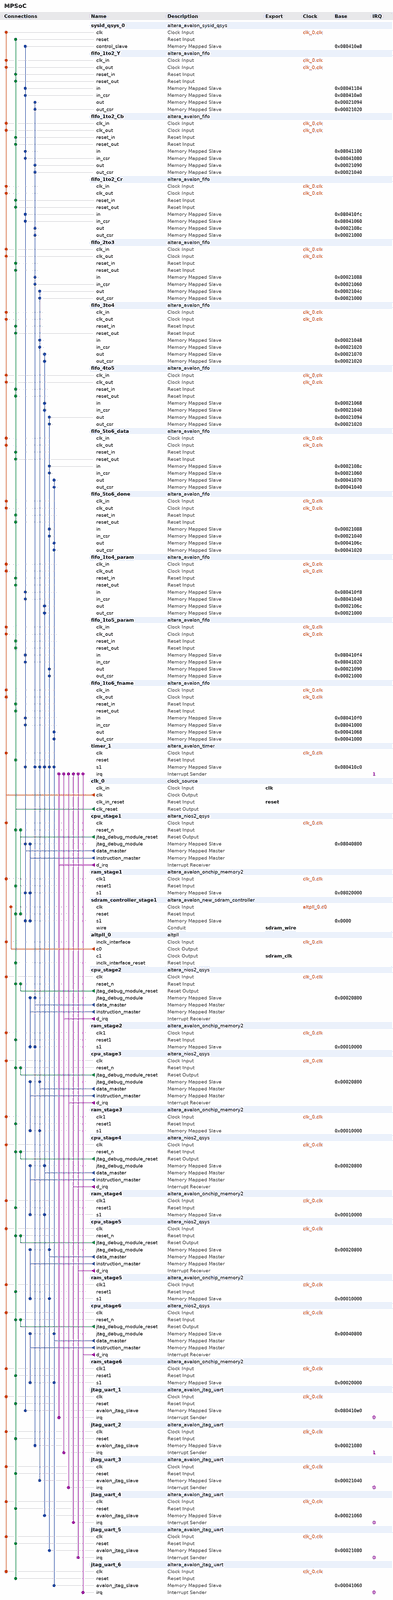
[diagram p0: system contents, whole]
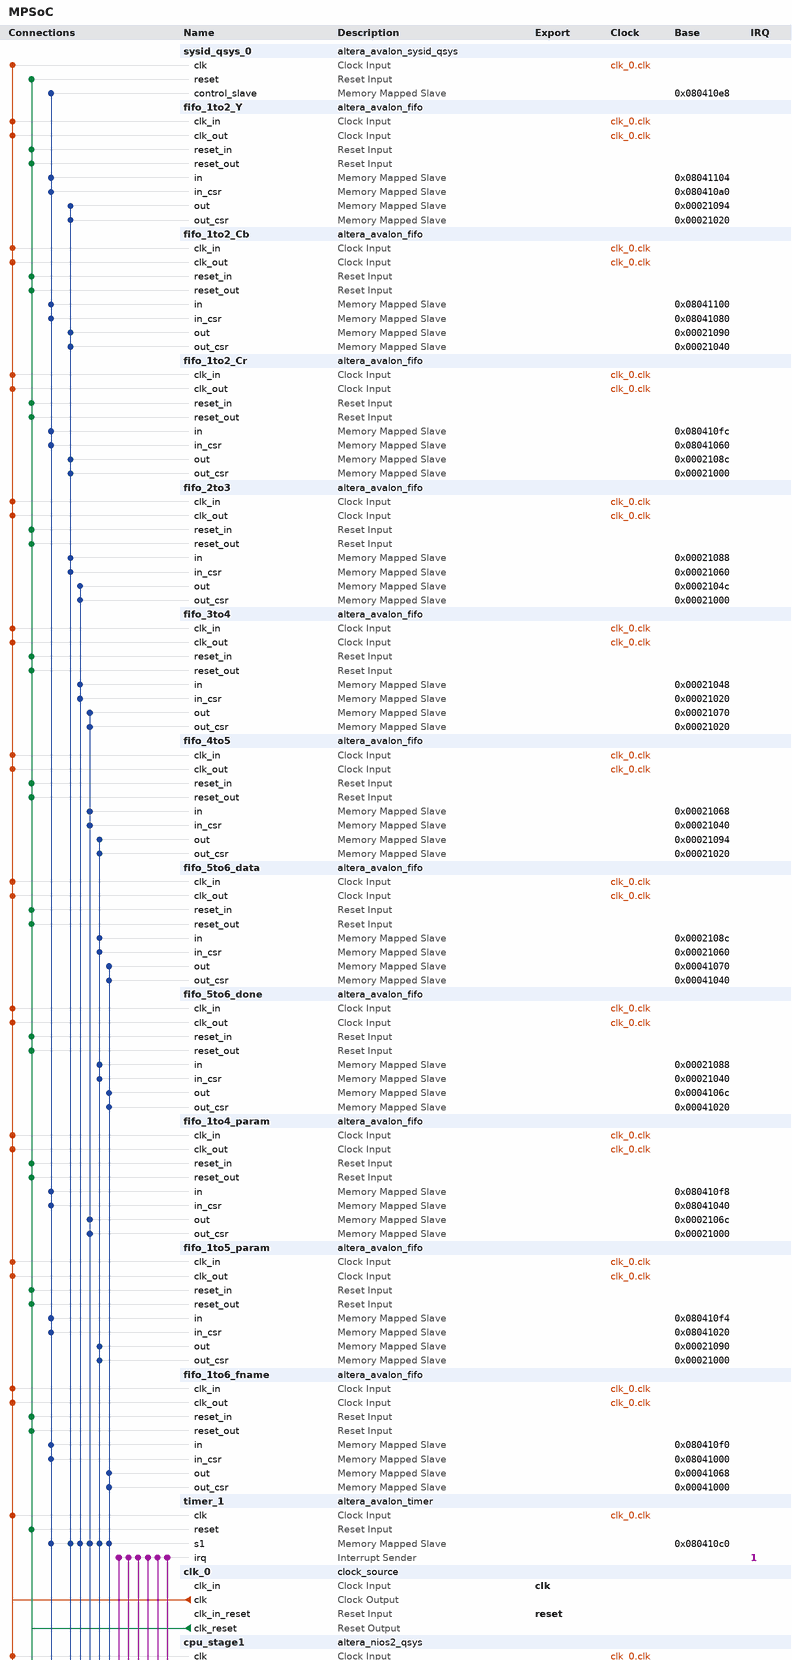
[diagram p1: system contents, upper part]
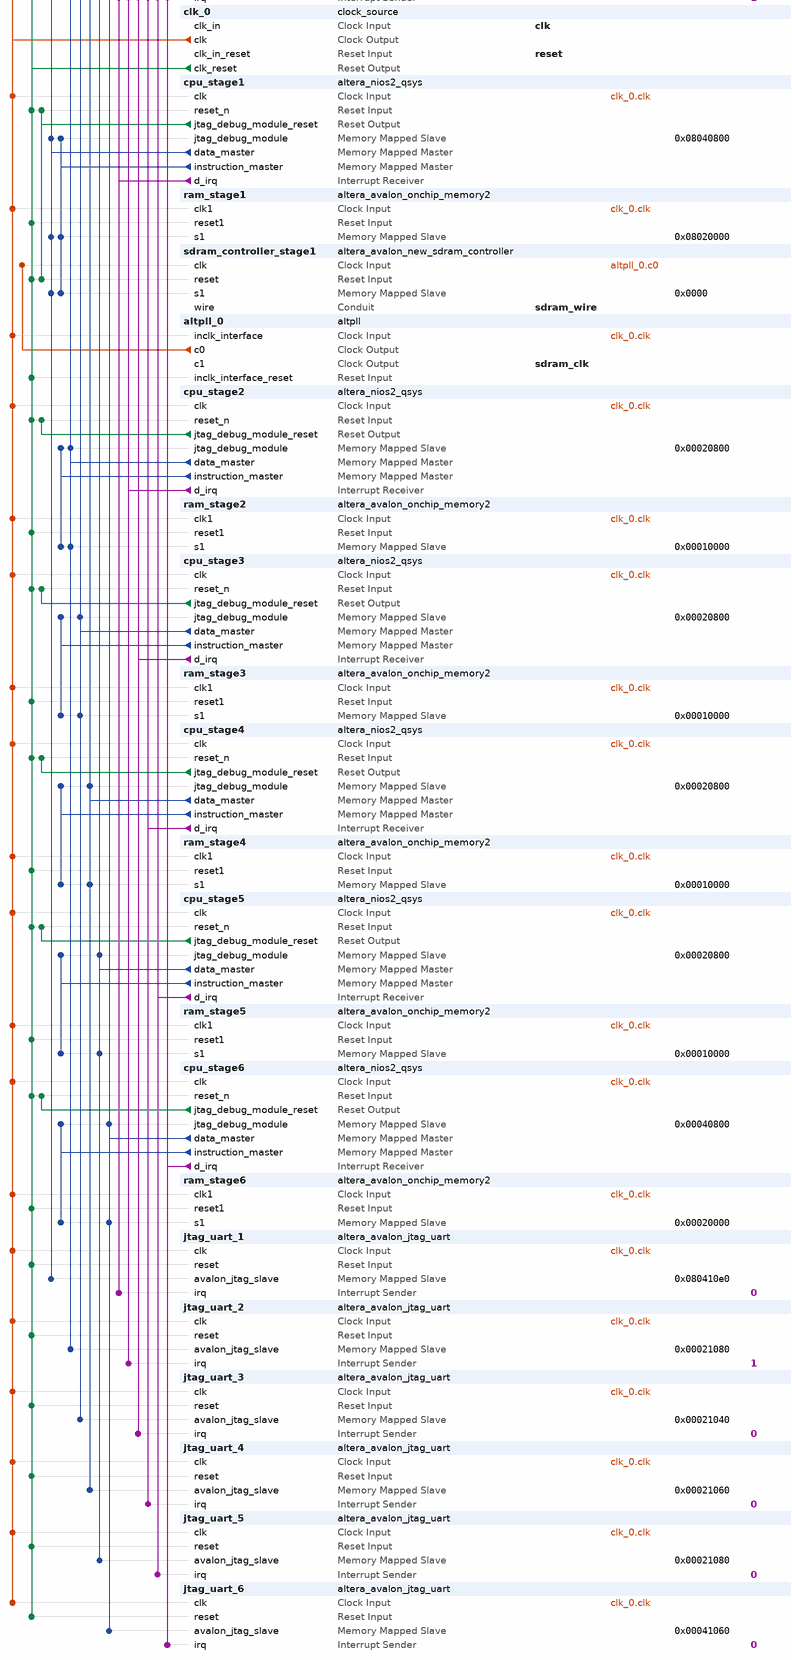
[diagram p2: system contents, lower part]
# Platform Designer (Qsys) system MPSoC, Cyclone IV E EP4CE115F29C7
# Parameters at their usual value, and those the tool derives, are not listed.
package require -exact qsys 13.1
create_system MPSoC
set_project_property DEVICE_FAMILY {Cyclone IV E}
set_project_property DEVICE EP4CE115F29C7

add_instance sysid_qsys_0 altera_avalon_sysid_qsys 13.1
set_instance_parameter_value sysid_qsys_0 id 0

add_instance fifo_1to2_Y altera_avalon_fifo 13.1
set_instance_parameter_value fifo_1to2_Y bitsPerSymbol 16
set_instance_parameter_value fifo_1to2_Y channelWidth 8
set_instance_parameter_value fifo_1to2_Y errorWidth 8
set_instance_parameter_value fifo_1to2_Y fifoDepth 64
set_instance_parameter_value fifo_1to2_Y fifoInputInterfaceOptions AVALONMM_WRITE
set_instance_parameter_value fifo_1to2_Y fifoOutputInterfaceOptions AVALONMM_READ
set_instance_parameter_value fifo_1to2_Y singleClockMode false
set_instance_parameter_value fifo_1to2_Y symbolsPerBeat 1
set_instance_parameter_value fifo_1to2_Y useIRQ false
set_instance_parameter_value fifo_1to2_Y usePacket false
set_instance_parameter_value fifo_1to2_Y useReadControl true

add_instance fifo_1to2_Cb altera_avalon_fifo 13.1
set_instance_parameter_value fifo_1to2_Cb bitsPerSymbol 16
set_instance_parameter_value fifo_1to2_Cb channelWidth 8
set_instance_parameter_value fifo_1to2_Cb errorWidth 8
set_instance_parameter_value fifo_1to2_Cb fifoDepth 64
set_instance_parameter_value fifo_1to2_Cb fifoInputInterfaceOptions AVALONMM_WRITE
set_instance_parameter_value fifo_1to2_Cb fifoOutputInterfaceOptions AVALONMM_READ
set_instance_parameter_value fifo_1to2_Cb singleClockMode false
set_instance_parameter_value fifo_1to2_Cb symbolsPerBeat 1
set_instance_parameter_value fifo_1to2_Cb useIRQ false
set_instance_parameter_value fifo_1to2_Cb usePacket false
set_instance_parameter_value fifo_1to2_Cb useReadControl true

add_instance fifo_1to2_Cr altera_avalon_fifo 13.1
set_instance_parameter_value fifo_1to2_Cr bitsPerSymbol 16
set_instance_parameter_value fifo_1to2_Cr channelWidth 8
set_instance_parameter_value fifo_1to2_Cr errorWidth 8
set_instance_parameter_value fifo_1to2_Cr fifoDepth 64
set_instance_parameter_value fifo_1to2_Cr fifoInputInterfaceOptions AVALONMM_WRITE
set_instance_parameter_value fifo_1to2_Cr fifoOutputInterfaceOptions AVALONMM_READ
set_instance_parameter_value fifo_1to2_Cr singleClockMode false
set_instance_parameter_value fifo_1to2_Cr symbolsPerBeat 1
set_instance_parameter_value fifo_1to2_Cr useIRQ false
set_instance_parameter_value fifo_1to2_Cr usePacket false
set_instance_parameter_value fifo_1to2_Cr useReadControl true

add_instance fifo_2to3 altera_avalon_fifo 13.1
set_instance_parameter_value fifo_2to3 bitsPerSymbol 16
set_instance_parameter_value fifo_2to3 channelWidth 8
set_instance_parameter_value fifo_2to3 errorWidth 8
set_instance_parameter_value fifo_2to3 fifoDepth 64
set_instance_parameter_value fifo_2to3 fifoInputInterfaceOptions AVALONMM_WRITE
set_instance_parameter_value fifo_2to3 fifoOutputInterfaceOptions AVALONMM_READ
set_instance_parameter_value fifo_2to3 singleClockMode false
set_instance_parameter_value fifo_2to3 symbolsPerBeat 1
set_instance_parameter_value fifo_2to3 useIRQ false
set_instance_parameter_value fifo_2to3 usePacket false
set_instance_parameter_value fifo_2to3 useReadControl true

add_instance fifo_3to4 altera_avalon_fifo 13.1
set_instance_parameter_value fifo_3to4 bitsPerSymbol 16
set_instance_parameter_value fifo_3to4 channelWidth 8
set_instance_parameter_value fifo_3to4 errorWidth 8
set_instance_parameter_value fifo_3to4 fifoDepth 64
set_instance_parameter_value fifo_3to4 fifoInputInterfaceOptions AVALONMM_WRITE
set_instance_parameter_value fifo_3to4 fifoOutputInterfaceOptions AVALONMM_READ
set_instance_parameter_value fifo_3to4 singleClockMode false
set_instance_parameter_value fifo_3to4 symbolsPerBeat 1
set_instance_parameter_value fifo_3to4 useIRQ false
set_instance_parameter_value fifo_3to4 usePacket false
set_instance_parameter_value fifo_3to4 useReadControl true

add_instance fifo_4to5 altera_avalon_fifo 13.1
set_instance_parameter_value fifo_4to5 bitsPerSymbol 16
set_instance_parameter_value fifo_4to5 channelWidth 8
set_instance_parameter_value fifo_4to5 errorWidth 8
set_instance_parameter_value fifo_4to5 fifoDepth 64
set_instance_parameter_value fifo_4to5 fifoInputInterfaceOptions AVALONMM_WRITE
set_instance_parameter_value fifo_4to5 fifoOutputInterfaceOptions AVALONMM_READ
set_instance_parameter_value fifo_4to5 singleClockMode false
set_instance_parameter_value fifo_4to5 symbolsPerBeat 1
set_instance_parameter_value fifo_4to5 useIRQ false
set_instance_parameter_value fifo_4to5 usePacket false
set_instance_parameter_value fifo_4to5 useReadControl true

add_instance fifo_5to6_data altera_avalon_fifo 13.1
set_instance_parameter_value fifo_5to6_data bitsPerSymbol 8
set_instance_parameter_value fifo_5to6_data channelWidth 8
set_instance_parameter_value fifo_5to6_data errorWidth 8
set_instance_parameter_value fifo_5to6_data fifoDepth 64
set_instance_parameter_value fifo_5to6_data fifoInputInterfaceOptions AVALONMM_WRITE
set_instance_parameter_value fifo_5to6_data fifoOutputInterfaceOptions AVALONMM_READ
set_instance_parameter_value fifo_5to6_data singleClockMode false
set_instance_parameter_value fifo_5to6_data symbolsPerBeat 1
set_instance_parameter_value fifo_5to6_data useIRQ false
set_instance_parameter_value fifo_5to6_data usePacket false
set_instance_parameter_value fifo_5to6_data useReadControl true

add_instance fifo_5to6_done altera_avalon_fifo 13.1
set_instance_parameter_value fifo_5to6_done bitsPerSymbol 8
set_instance_parameter_value fifo_5to6_done channelWidth 8
set_instance_parameter_value fifo_5to6_done errorWidth 8
set_instance_parameter_value fifo_5to6_done fifoDepth 8
set_instance_parameter_value fifo_5to6_done fifoInputInterfaceOptions AVALONMM_WRITE
set_instance_parameter_value fifo_5to6_done fifoOutputInterfaceOptions AVALONMM_READ
set_instance_parameter_value fifo_5to6_done singleClockMode false
set_instance_parameter_value fifo_5to6_done symbolsPerBeat 1
set_instance_parameter_value fifo_5to6_done useIRQ false
set_instance_parameter_value fifo_5to6_done usePacket false
set_instance_parameter_value fifo_5to6_done useReadControl true

add_instance fifo_1to4_param altera_avalon_fifo 13.1
set_instance_parameter_value fifo_1to4_param bitsPerSymbol 32
set_instance_parameter_value fifo_1to4_param channelWidth 8
set_instance_parameter_value fifo_1to4_param errorWidth 8
set_instance_parameter_value fifo_1to4_param fifoDepth 8
set_instance_parameter_value fifo_1to4_param fifoInputInterfaceOptions AVALONMM_WRITE
set_instance_parameter_value fifo_1to4_param fifoOutputInterfaceOptions AVALONMM_READ
set_instance_parameter_value fifo_1to4_param singleClockMode false
set_instance_parameter_value fifo_1to4_param symbolsPerBeat 1
set_instance_parameter_value fifo_1to4_param useIRQ false
set_instance_parameter_value fifo_1to4_param usePacket false
set_instance_parameter_value fifo_1to4_param useReadControl true

add_instance fifo_1to5_param altera_avalon_fifo 13.1
set_instance_parameter_value fifo_1to5_param bitsPerSymbol 32
set_instance_parameter_value fifo_1to5_param channelWidth 8
set_instance_parameter_value fifo_1to5_param errorWidth 8
set_instance_parameter_value fifo_1to5_param fifoDepth 8
set_instance_parameter_value fifo_1to5_param fifoInputInterfaceOptions AVALONMM_WRITE
set_instance_parameter_value fifo_1to5_param fifoOutputInterfaceOptions AVALONMM_READ
set_instance_parameter_value fifo_1to5_param singleClockMode false
set_instance_parameter_value fifo_1to5_param symbolsPerBeat 1
set_instance_parameter_value fifo_1to5_param useIRQ false
set_instance_parameter_value fifo_1to5_param usePacket false
set_instance_parameter_value fifo_1to5_param useReadControl true

add_instance fifo_1to6_fname altera_avalon_fifo 13.1
set_instance_parameter_value fifo_1to6_fname bitsPerSymbol 8
set_instance_parameter_value fifo_1to6_fname channelWidth 8
set_instance_parameter_value fifo_1to6_fname errorWidth 8
set_instance_parameter_value fifo_1to6_fname fifoDepth 128
set_instance_parameter_value fifo_1to6_fname fifoInputInterfaceOptions AVALONMM_WRITE
set_instance_parameter_value fifo_1to6_fname fifoOutputInterfaceOptions AVALONMM_READ
set_instance_parameter_value fifo_1to6_fname singleClockMode false
set_instance_parameter_value fifo_1to6_fname symbolsPerBeat 1
set_instance_parameter_value fifo_1to6_fname useIRQ false
set_instance_parameter_value fifo_1to6_fname usePacket false
set_instance_parameter_value fifo_1to6_fname useReadControl true

add_instance timer_1 altera_avalon_timer 13.1
set_instance_parameter_value timer_1 period 1
set_instance_parameter_value timer_1 periodUnits MSEC

add_instance clk_0 clock_source 13.1
set_instance_parameter_value clk_0 clockFrequency 50000000

add_instance cpu_stage1 altera_nios2_qsys 13.1
set_instance_parameter_value cpu_stage1 resetSlave ram_stage1.s1
set_instance_parameter_value cpu_stage1 mmu_TLBMissExcSlave None
set_instance_parameter_value cpu_stage1 exceptionSlave ram_stage1.s1
set_instance_parameter_value cpu_stage1 breakSlave cpu_stage1.jtag_debug_module
set_instance_parameter_value cpu_stage1 impl Tiny
set_instance_parameter_value cpu_stage1 icache_size 4096

add_instance ram_stage1 altera_avalon_onchip_memory2 13.1
set_instance_parameter_value ram_stage1 dataWidth 32
set_instance_parameter_value ram_stage1 dualPort false
set_instance_parameter_value ram_stage1 initMemContent true
set_instance_parameter_value ram_stage1 initializationFileName onchip_mem.hex
set_instance_parameter_value ram_stage1 memorySize 96000

add_instance sdram_controller_stage1 altera_avalon_new_sdram_controller 13.1
set_instance_parameter_value sdram_controller_stage1 TAC 6.0
set_instance_parameter_value sdram_controller_stage1 TRCD 20.0
set_instance_parameter_value sdram_controller_stage1 TRP 20.0
set_instance_parameter_value sdram_controller_stage1 casLatency 3
set_instance_parameter_value sdram_controller_stage1 columnWidth 10
set_instance_parameter_value sdram_controller_stage1 dataWidth 32
set_instance_parameter_value sdram_controller_stage1 generateSimulationModel false
set_instance_parameter_value sdram_controller_stage1 model single_Micron_MT48LC4M32B2_7_chip
set_instance_parameter_value sdram_controller_stage1 numberOfBanks 4
set_instance_parameter_value sdram_controller_stage1 numberOfChipSelects 1
set_instance_parameter_value sdram_controller_stage1 powerUpDelay 100.0
set_instance_parameter_value sdram_controller_stage1 refreshPeriod 15.625
set_instance_parameter_value sdram_controller_stage1 rowWidth 13

add_instance altpll_0 altpll 13.1
set_instance_parameter_value altpll_0 INCLK0_INPUT_FREQUENCY 20000
set_instance_parameter_value altpll_0 CLK0_MULTIPLY_BY 2
set_instance_parameter_value altpll_0 CLK1_MULTIPLY_BY 2
set_instance_parameter_value altpll_0 CLK0_DIVIDE_BY 1
set_instance_parameter_value altpll_0 CLK1_DIVIDE_BY 1
set_instance_parameter_value altpll_0 CLK1_PHASE_SHIFT -1806
set_instance_parameter_value altpll_0 CLK1_DUTY_CYCLE 50
set_instance_parameter_value altpll_0 PORT_clk1 PORT_USED
set_instance_parameter_value altpll_0 PORT_clk2 PORT_UNUSED
set_instance_parameter_value altpll_0 PORT_clk3 PORT_UNUSED
set_instance_parameter_value altpll_0 PORT_ARESET PORT_USED
set_instance_parameter_value altpll_0 PORT_LOCKED PORT_USED

add_instance cpu_stage2 altera_nios2_qsys 13.1
set_instance_parameter_value cpu_stage2 cpuID 1
set_instance_parameter_value cpu_stage2 resetSlave ram_stage2.s1
set_instance_parameter_value cpu_stage2 mmu_TLBMissExcSlave None
set_instance_parameter_value cpu_stage2 exceptionSlave ram_stage2.s1
set_instance_parameter_value cpu_stage2 breakSlave cpu_stage2.jtag_debug_module
set_instance_parameter_value cpu_stage2 impl Tiny
set_instance_parameter_value cpu_stage2 icache_size 4096

add_instance ram_stage2 altera_avalon_onchip_memory2 13.1
set_instance_parameter_value ram_stage2 dataWidth 32
set_instance_parameter_value ram_stage2 dualPort false
set_instance_parameter_value ram_stage2 initMemContent true
set_instance_parameter_value ram_stage2 initializationFileName onchip_mem.hex
set_instance_parameter_value ram_stage2 memorySize 40000

add_instance cpu_stage3 altera_nios2_qsys 13.1
set_instance_parameter_value cpu_stage3 cpuID 2
set_instance_parameter_value cpu_stage3 resetSlave ram_stage3.s1
set_instance_parameter_value cpu_stage3 mmu_TLBMissExcSlave None
set_instance_parameter_value cpu_stage3 exceptionSlave ram_stage3.s1
set_instance_parameter_value cpu_stage3 breakSlave cpu_stage3.jtag_debug_module
set_instance_parameter_value cpu_stage3 impl Tiny
set_instance_parameter_value cpu_stage3 icache_size 4096

add_instance ram_stage3 altera_avalon_onchip_memory2 13.1
set_instance_parameter_value ram_stage3 dataWidth 32
set_instance_parameter_value ram_stage3 dualPort false
set_instance_parameter_value ram_stage3 initMemContent true
set_instance_parameter_value ram_stage3 initializationFileName onchip_mem.hex
set_instance_parameter_value ram_stage3 memorySize 48000

add_instance cpu_stage4 altera_nios2_qsys 13.1
set_instance_parameter_value cpu_stage4 cpuID 3
set_instance_parameter_value cpu_stage4 resetSlave ram_stage4.s1
set_instance_parameter_value cpu_stage4 mmu_TLBMissExcSlave None
set_instance_parameter_value cpu_stage4 exceptionSlave ram_stage4.s1
set_instance_parameter_value cpu_stage4 breakSlave cpu_stage4.jtag_debug_module
set_instance_parameter_value cpu_stage4 impl Tiny
set_instance_parameter_value cpu_stage4 icache_size 4096

add_instance ram_stage4 altera_avalon_onchip_memory2 13.1
set_instance_parameter_value ram_stage4 dataWidth 32
set_instance_parameter_value ram_stage4 dualPort false
set_instance_parameter_value ram_stage4 initMemContent true
set_instance_parameter_value ram_stage4 initializationFileName onchip_mem.hex
set_instance_parameter_value ram_stage4 memorySize 48000

add_instance cpu_stage5 altera_nios2_qsys 13.1
set_instance_parameter_value cpu_stage5 cpuID 4
set_instance_parameter_value cpu_stage5 resetSlave ram_stage5.s1
set_instance_parameter_value cpu_stage5 mmu_TLBMissExcSlave None
set_instance_parameter_value cpu_stage5 exceptionSlave ram_stage5.s1
set_instance_parameter_value cpu_stage5 breakSlave cpu_stage5.jtag_debug_module
set_instance_parameter_value cpu_stage5 impl Tiny
set_instance_parameter_value cpu_stage5 icache_size 4096

add_instance ram_stage5 altera_avalon_onchip_memory2 13.1
set_instance_parameter_value ram_stage5 dataWidth 32
set_instance_parameter_value ram_stage5 dualPort false
set_instance_parameter_value ram_stage5 initMemContent true
set_instance_parameter_value ram_stage5 initializationFileName onchip_mem.hex
set_instance_parameter_value ram_stage5 memorySize 49152

add_instance cpu_stage6 altera_nios2_qsys 13.1
set_instance_parameter_value cpu_stage6 cpuID 5
set_instance_parameter_value cpu_stage6 resetSlave ram_stage6.s1
set_instance_parameter_value cpu_stage6 mmu_TLBMissExcSlave None
set_instance_parameter_value cpu_stage6 exceptionSlave ram_stage6.s1
set_instance_parameter_value cpu_stage6 breakSlave cpu_stage6.jtag_debug_module
set_instance_parameter_value cpu_stage6 impl Tiny
set_instance_parameter_value cpu_stage6 icache_size 4096

add_instance ram_stage6 altera_avalon_onchip_memory2 13.1
set_instance_parameter_value ram_stage6 dataWidth 32
set_instance_parameter_value ram_stage6 dualPort false
set_instance_parameter_value ram_stage6 initMemContent true
set_instance_parameter_value ram_stage6 initializationFileName onchip_mem.hex
set_instance_parameter_value ram_stage6 memorySize 96000

add_instance jtag_uart_1 altera_avalon_jtag_uart 13.1
set_instance_parameter_value jtag_uart_1 simInteractiveOptions NO_INTERACTIVE_WINDOWS

add_instance jtag_uart_2 altera_avalon_jtag_uart 13.1
set_instance_parameter_value jtag_uart_2 simInteractiveOptions NO_INTERACTIVE_WINDOWS

add_instance jtag_uart_3 altera_avalon_jtag_uart 13.1
set_instance_parameter_value jtag_uart_3 simInteractiveOptions NO_INTERACTIVE_WINDOWS

add_instance jtag_uart_4 altera_avalon_jtag_uart 13.1
set_instance_parameter_value jtag_uart_4 simInteractiveOptions NO_INTERACTIVE_WINDOWS

add_instance jtag_uart_5 altera_avalon_jtag_uart 13.1
set_instance_parameter_value jtag_uart_5 simInteractiveOptions NO_INTERACTIVE_WINDOWS

add_instance jtag_uart_6 altera_avalon_jtag_uart 13.1
set_instance_parameter_value jtag_uart_6 simInteractiveOptions NO_INTERACTIVE_WINDOWS

# connections
add_connection altpll_0.c0 sdram_controller_stage1.clk clock
add_connection clk_0.clk altpll_0.inclk_interface clock
add_connection clk_0.clk cpu_stage1.clk clock
add_connection clk_0.clk cpu_stage2.clk clock
add_connection clk_0.clk cpu_stage3.clk clock
add_connection clk_0.clk cpu_stage4.clk clock
add_connection clk_0.clk cpu_stage5.clk clock
add_connection clk_0.clk cpu_stage6.clk clock
add_connection clk_0.clk fifo_1to2_Cb.clk_in clock
add_connection clk_0.clk fifo_1to2_Cb.clk_out clock
add_connection clk_0.clk fifo_1to2_Cr.clk_in clock
add_connection clk_0.clk fifo_1to2_Cr.clk_out clock
add_connection clk_0.clk fifo_1to2_Y.clk_in clock
add_connection clk_0.clk fifo_1to2_Y.clk_out clock
add_connection clk_0.clk fifo_1to4_param.clk_in clock
add_connection clk_0.clk fifo_1to4_param.clk_out clock
add_connection clk_0.clk fifo_1to5_param.clk_in clock
add_connection clk_0.clk fifo_1to5_param.clk_out clock
add_connection clk_0.clk fifo_1to6_fname.clk_in clock
add_connection clk_0.clk fifo_1to6_fname.clk_out clock
add_connection clk_0.clk fifo_2to3.clk_in clock
add_connection clk_0.clk fifo_2to3.clk_out clock
add_connection clk_0.clk fifo_3to4.clk_in clock
add_connection clk_0.clk fifo_3to4.clk_out clock
add_connection clk_0.clk fifo_4to5.clk_in clock
add_connection clk_0.clk fifo_4to5.clk_out clock
add_connection clk_0.clk fifo_5to6_data.clk_in clock
add_connection clk_0.clk fifo_5to6_data.clk_out clock
add_connection clk_0.clk fifo_5to6_done.clk_in clock
add_connection clk_0.clk fifo_5to6_done.clk_out clock
add_connection clk_0.clk jtag_uart_1.clk clock
add_connection clk_0.clk jtag_uart_2.clk clock
add_connection clk_0.clk jtag_uart_3.clk clock
add_connection clk_0.clk jtag_uart_4.clk clock
add_connection clk_0.clk jtag_uart_5.clk clock
add_connection clk_0.clk jtag_uart_6.clk clock
add_connection clk_0.clk ram_stage1.clk1 clock
add_connection clk_0.clk ram_stage2.clk1 clock
add_connection clk_0.clk ram_stage3.clk1 clock
add_connection clk_0.clk ram_stage4.clk1 clock
add_connection clk_0.clk ram_stage5.clk1 clock
add_connection clk_0.clk ram_stage6.clk1 clock
add_connection clk_0.clk sysid_qsys_0.clk clock
add_connection clk_0.clk timer_1.clk clock
add_connection clk_0.clk_reset altpll_0.inclk_interface_reset reset
add_connection clk_0.clk_reset cpu_stage1.reset_n reset
add_connection clk_0.clk_reset cpu_stage2.reset_n reset
add_connection clk_0.clk_reset cpu_stage3.reset_n reset
add_connection clk_0.clk_reset cpu_stage4.reset_n reset
add_connection clk_0.clk_reset cpu_stage5.reset_n reset
add_connection clk_0.clk_reset cpu_stage6.reset_n reset
add_connection clk_0.clk_reset fifo_1to2_Cb.reset_in reset
add_connection clk_0.clk_reset fifo_1to2_Cb.reset_out reset
add_connection clk_0.clk_reset fifo_1to2_Cr.reset_in reset
add_connection clk_0.clk_reset fifo_1to2_Cr.reset_out reset
add_connection clk_0.clk_reset fifo_1to2_Y.reset_in reset
add_connection clk_0.clk_reset fifo_1to2_Y.reset_out reset
add_connection clk_0.clk_reset fifo_1to4_param.reset_in reset
add_connection clk_0.clk_reset fifo_1to4_param.reset_out reset
add_connection clk_0.clk_reset fifo_1to5_param.reset_in reset
add_connection clk_0.clk_reset fifo_1to5_param.reset_out reset
add_connection clk_0.clk_reset fifo_1to6_fname.reset_in reset
add_connection clk_0.clk_reset fifo_1to6_fname.reset_out reset
add_connection clk_0.clk_reset fifo_2to3.reset_in reset
add_connection clk_0.clk_reset fifo_2to3.reset_out reset
add_connection clk_0.clk_reset fifo_3to4.reset_in reset
add_connection clk_0.clk_reset fifo_3to4.reset_out reset
add_connection clk_0.clk_reset fifo_4to5.reset_in reset
add_connection clk_0.clk_reset fifo_4to5.reset_out reset
add_connection clk_0.clk_reset fifo_5to6_data.reset_in reset
add_connection clk_0.clk_reset fifo_5to6_data.reset_out reset
add_connection clk_0.clk_reset fifo_5to6_done.reset_in reset
add_connection clk_0.clk_reset fifo_5to6_done.reset_out reset
add_connection clk_0.clk_reset jtag_uart_1.reset reset
add_connection clk_0.clk_reset jtag_uart_2.reset reset
add_connection clk_0.clk_reset jtag_uart_3.reset reset
add_connection clk_0.clk_reset jtag_uart_4.reset reset
add_connection clk_0.clk_reset jtag_uart_5.reset reset
add_connection clk_0.clk_reset jtag_uart_6.reset reset
add_connection clk_0.clk_reset ram_stage1.reset1 reset
add_connection clk_0.clk_reset ram_stage2.reset1 reset
add_connection clk_0.clk_reset ram_stage3.reset1 reset
add_connection clk_0.clk_reset ram_stage4.reset1 reset
add_connection clk_0.clk_reset ram_stage5.reset1 reset
add_connection clk_0.clk_reset ram_stage6.reset1 reset
add_connection clk_0.clk_reset sdram_controller_stage1.reset reset
add_connection clk_0.clk_reset sysid_qsys_0.reset reset
add_connection clk_0.clk_reset timer_1.reset reset
add_connection cpu_stage1.jtag_debug_module_reset cpu_stage1.reset_n reset
add_connection cpu_stage1.jtag_debug_module_reset sdram_controller_stage1.reset reset
add_connection cpu_stage2.jtag_debug_module_reset cpu_stage2.reset_n reset
add_connection cpu_stage3.jtag_debug_module_reset cpu_stage3.reset_n reset
add_connection cpu_stage4.jtag_debug_module_reset cpu_stage4.reset_n reset
add_connection cpu_stage5.jtag_debug_module_reset cpu_stage5.reset_n reset
add_connection cpu_stage6.jtag_debug_module_reset cpu_stage6.reset_n reset
add_connection cpu_stage1.data_master cpu_stage1.jtag_debug_module avalon
set_connection_parameter_value cpu_stage1.data_master/cpu_stage1.jtag_debug_module baseAddress 0x08040800
add_connection cpu_stage1.data_master fifo_1to2_Cb.in avalon
set_connection_parameter_value cpu_stage1.data_master/fifo_1to2_Cb.in baseAddress 0x08041100
add_connection cpu_stage1.data_master fifo_1to2_Cb.in_csr avalon
set_connection_parameter_value cpu_stage1.data_master/fifo_1to2_Cb.in_csr baseAddress 0x08041080
add_connection cpu_stage1.data_master fifo_1to2_Cr.in avalon
set_connection_parameter_value cpu_stage1.data_master/fifo_1to2_Cr.in baseAddress 0x080410fc
add_connection cpu_stage1.data_master fifo_1to2_Cr.in_csr avalon
set_connection_parameter_value cpu_stage1.data_master/fifo_1to2_Cr.in_csr baseAddress 0x08041060
add_connection cpu_stage1.data_master fifo_1to2_Y.in avalon
set_connection_parameter_value cpu_stage1.data_master/fifo_1to2_Y.in baseAddress 0x08041104
add_connection cpu_stage1.data_master fifo_1to2_Y.in_csr avalon
set_connection_parameter_value cpu_stage1.data_master/fifo_1to2_Y.in_csr baseAddress 0x080410a0
add_connection cpu_stage1.data_master fifo_1to4_param.in avalon
set_connection_parameter_value cpu_stage1.data_master/fifo_1to4_param.in baseAddress 0x080410f8
add_connection cpu_stage1.data_master fifo_1to4_param.in_csr avalon
set_connection_parameter_value cpu_stage1.data_master/fifo_1to4_param.in_csr baseAddress 0x08041040
add_connection cpu_stage1.data_master fifo_1to5_param.in avalon
set_connection_parameter_value cpu_stage1.data_master/fifo_1to5_param.in baseAddress 0x080410f4
add_connection cpu_stage1.data_master fifo_1to5_param.in_csr avalon
set_connection_parameter_value cpu_stage1.data_master/fifo_1to5_param.in_csr baseAddress 0x08041020
add_connection cpu_stage1.data_master fifo_1to6_fname.in avalon
set_connection_parameter_value cpu_stage1.data_master/fifo_1to6_fname.in baseAddress 0x080410f0
add_connection cpu_stage1.data_master fifo_1to6_fname.in_csr avalon
set_connection_parameter_value cpu_stage1.data_master/fifo_1to6_fname.in_csr baseAddress 0x08041000
add_connection cpu_stage1.data_master jtag_uart_1.avalon_jtag_slave avalon
set_connection_parameter_value cpu_stage1.data_master/jtag_uart_1.avalon_jtag_slave baseAddress 0x080410e0
add_connection cpu_stage1.data_master ram_stage1.s1 avalon
set_connection_parameter_value cpu_stage1.data_master/ram_stage1.s1 baseAddress 0x08020000
add_connection cpu_stage1.data_master sdram_controller_stage1.s1 avalon
set_connection_parameter_value cpu_stage1.data_master/sdram_controller_stage1.s1 baseAddress 0x0000
add_connection cpu_stage1.data_master sysid_qsys_0.control_slave avalon
set_connection_parameter_value cpu_stage1.data_master/sysid_qsys_0.control_slave baseAddress 0x080410e8
add_connection cpu_stage1.data_master timer_1.s1 avalon
set_connection_parameter_value cpu_stage1.data_master/timer_1.s1 baseAddress 0x080410c0
add_connection cpu_stage1.instruction_master cpu_stage1.jtag_debug_module avalon
set_connection_parameter_value cpu_stage1.instruction_master/cpu_stage1.jtag_debug_module baseAddress 0x08040800
add_connection cpu_stage1.instruction_master ram_stage1.s1 avalon
set_connection_parameter_value cpu_stage1.instruction_master/ram_stage1.s1 baseAddress 0x08020000
add_connection cpu_stage1.instruction_master sdram_controller_stage1.s1 avalon
set_connection_parameter_value cpu_stage1.instruction_master/sdram_controller_stage1.s1 baseAddress 0x0000
add_connection cpu_stage2.data_master cpu_stage2.jtag_debug_module avalon
set_connection_parameter_value cpu_stage2.data_master/cpu_stage2.jtag_debug_module baseAddress 0x00020800
add_connection cpu_stage2.data_master fifo_1to2_Cb.out avalon
set_connection_parameter_value cpu_stage2.data_master/fifo_1to2_Cb.out baseAddress 0x00021090
add_connection cpu_stage2.data_master fifo_1to2_Cb.out_csr avalon
set_connection_parameter_value cpu_stage2.data_master/fifo_1to2_Cb.out_csr baseAddress 0x00021040
add_connection cpu_stage2.data_master fifo_1to2_Cr.out avalon
set_connection_parameter_value cpu_stage2.data_master/fifo_1to2_Cr.out baseAddress 0x0002108c
add_connection cpu_stage2.data_master fifo_1to2_Cr.out_csr avalon
set_connection_parameter_value cpu_stage2.data_master/fifo_1to2_Cr.out_csr baseAddress 0x00021000
add_connection cpu_stage2.data_master fifo_1to2_Y.out avalon
set_connection_parameter_value cpu_stage2.data_master/fifo_1to2_Y.out baseAddress 0x00021094
add_connection cpu_stage2.data_master fifo_1to2_Y.out_csr avalon
set_connection_parameter_value cpu_stage2.data_master/fifo_1to2_Y.out_csr baseAddress 0x00021020
add_connection cpu_stage2.data_master fifo_2to3.in avalon
set_connection_parameter_value cpu_stage2.data_master/fifo_2to3.in baseAddress 0x00021088
add_connection cpu_stage2.data_master fifo_2to3.in_csr avalon
set_connection_parameter_value cpu_stage2.data_master/fifo_2to3.in_csr baseAddress 0x00021060
add_connection cpu_stage2.data_master jtag_uart_2.avalon_jtag_slave avalon
set_connection_parameter_value cpu_stage2.data_master/jtag_uart_2.avalon_jtag_slave baseAddress 0x00021080
add_connection cpu_stage2.data_master ram_stage2.s1 avalon
set_connection_parameter_value cpu_stage2.data_master/ram_stage2.s1 baseAddress 0x00010000
add_connection cpu_stage2.data_master timer_1.s1 avalon
set_connection_parameter_value cpu_stage2.data_master/timer_1.s1 baseAddress 0x080410c0
add_connection cpu_stage2.instruction_master cpu_stage2.jtag_debug_module avalon
set_connection_parameter_value cpu_stage2.instruction_master/cpu_stage2.jtag_debug_module baseAddress 0x00020800
add_connection cpu_stage2.instruction_master ram_stage2.s1 avalon
set_connection_parameter_value cpu_stage2.instruction_master/ram_stage2.s1 baseAddress 0x00010000
add_connection cpu_stage3.data_master cpu_stage3.jtag_debug_module avalon
set_connection_parameter_value cpu_stage3.data_master/cpu_stage3.jtag_debug_module baseAddress 0x00020800
add_connection cpu_stage3.data_master fifo_2to3.out avalon
set_connection_parameter_value cpu_stage3.data_master/fifo_2to3.out baseAddress 0x0002104c
add_connection cpu_stage3.data_master fifo_2to3.out_csr avalon
set_connection_parameter_value cpu_stage3.data_master/fifo_2to3.out_csr baseAddress 0x00021000
add_connection cpu_stage3.data_master fifo_3to4.in avalon
set_connection_parameter_value cpu_stage3.data_master/fifo_3to4.in baseAddress 0x00021048
add_connection cpu_stage3.data_master fifo_3to4.in_csr avalon
set_connection_parameter_value cpu_stage3.data_master/fifo_3to4.in_csr baseAddress 0x00021020
add_connection cpu_stage3.data_master jtag_uart_3.avalon_jtag_slave avalon
set_connection_parameter_value cpu_stage3.data_master/jtag_uart_3.avalon_jtag_slave baseAddress 0x00021040
add_connection cpu_stage3.data_master ram_stage3.s1 avalon
set_connection_parameter_value cpu_stage3.data_master/ram_stage3.s1 baseAddress 0x00010000
add_connection cpu_stage3.data_master timer_1.s1 avalon
set_connection_parameter_value cpu_stage3.data_master/timer_1.s1 baseAddress 0x080410c0
add_connection cpu_stage3.instruction_master cpu_stage3.jtag_debug_module avalon
set_connection_parameter_value cpu_stage3.instruction_master/cpu_stage3.jtag_debug_module baseAddress 0x00020800
add_connection cpu_stage3.instruction_master ram_stage3.s1 avalon
set_connection_parameter_value cpu_stage3.instruction_master/ram_stage3.s1 baseAddress 0x00010000
add_connection cpu_stage4.data_master cpu_stage4.jtag_debug_module avalon
set_connection_parameter_value cpu_stage4.data_master/cpu_stage4.jtag_debug_module baseAddress 0x00020800
add_connection cpu_stage4.data_master fifo_1to4_param.out avalon
set_connection_parameter_value cpu_stage4.data_master/fifo_1to4_param.out baseAddress 0x0002106c
add_connection cpu_stage4.data_master fifo_1to4_param.out_csr avalon
set_connection_parameter_value cpu_stage4.data_master/fifo_1to4_param.out_csr baseAddress 0x00021000
add_connection cpu_stage4.data_master fifo_3to4.out avalon
set_connection_parameter_value cpu_stage4.data_master/fifo_3to4.out baseAddress 0x00021070
add_connection cpu_stage4.data_master fifo_3to4.out_csr avalon
set_connection_parameter_value cpu_stage4.data_master/fifo_3to4.out_csr baseAddress 0x00021020
add_connection cpu_stage4.data_master fifo_4to5.in avalon
set_connection_parameter_value cpu_stage4.data_master/fifo_4to5.in baseAddress 0x00021068
add_connection cpu_stage4.data_master fifo_4to5.in_csr avalon
set_connection_parameter_value cpu_stage4.data_master/fifo_4to5.in_csr baseAddress 0x00021040
add_connection cpu_stage4.data_master jtag_uart_4.avalon_jtag_slave avalon
set_connection_parameter_value cpu_stage4.data_master/jtag_uart_4.avalon_jtag_slave baseAddress 0x00021060
add_connection cpu_stage4.data_master ram_stage4.s1 avalon
set_connection_parameter_value cpu_stage4.data_master/ram_stage4.s1 baseAddress 0x00010000
add_connection cpu_stage4.data_master timer_1.s1 avalon
set_connection_parameter_value cpu_stage4.data_master/timer_1.s1 baseAddress 0x080410c0
add_connection cpu_stage4.instruction_master cpu_stage4.jtag_debug_module avalon
set_connection_parameter_value cpu_stage4.instruction_master/cpu_stage4.jtag_debug_module baseAddress 0x00020800
add_connection cpu_stage4.instruction_master ram_stage4.s1 avalon
set_connection_parameter_value cpu_stage4.instruction_master/ram_stage4.s1 baseAddress 0x00010000
add_connection cpu_stage5.data_master cpu_stage5.jtag_debug_module avalon
set_connection_parameter_value cpu_stage5.data_master/cpu_stage5.jtag_debug_module baseAddress 0x00020800
add_connection cpu_stage5.data_master fifo_1to5_param.out avalon
set_connection_parameter_value cpu_stage5.data_master/fifo_1to5_param.out baseAddress 0x00021090
add_connection cpu_stage5.data_master fifo_1to5_param.out_csr avalon
set_connection_parameter_value cpu_stage5.data_master/fifo_1to5_param.out_csr baseAddress 0x00021000
add_connection cpu_stage5.data_master fifo_4to5.out avalon
set_connection_parameter_value cpu_stage5.data_master/fifo_4to5.out baseAddress 0x00021094
add_connection cpu_stage5.data_master fifo_4to5.out_csr avalon
set_connection_parameter_value cpu_stage5.data_master/fifo_4to5.out_csr baseAddress 0x00021020
add_connection cpu_stage5.data_master fifo_5to6_data.in avalon
set_connection_parameter_value cpu_stage5.data_master/fifo_5to6_data.in baseAddress 0x0002108c
add_connection cpu_stage5.data_master fifo_5to6_data.in_csr avalon
set_connection_parameter_value cpu_stage5.data_master/fifo_5to6_data.in_csr baseAddress 0x00021060
add_connection cpu_stage5.data_master fifo_5to6_done.in avalon
set_connection_parameter_value cpu_stage5.data_master/fifo_5to6_done.in baseAddress 0x00021088
add_connection cpu_stage5.data_master fifo_5to6_done.in_csr avalon
set_connection_parameter_value cpu_stage5.data_master/fifo_5to6_done.in_csr baseAddress 0x00021040
add_connection cpu_stage5.data_master jtag_uart_5.avalon_jtag_slave avalon
set_connection_parameter_value cpu_stage5.data_master/jtag_uart_5.avalon_jtag_slave baseAddress 0x00021080
add_connection cpu_stage5.data_master ram_stage5.s1 avalon
set_connection_parameter_value cpu_stage5.data_master/ram_stage5.s1 baseAddress 0x00010000
add_connection cpu_stage5.data_master timer_1.s1 avalon
set_connection_parameter_value cpu_stage5.data_master/timer_1.s1 baseAddress 0x080410c0
add_connection cpu_stage5.instruction_master cpu_stage5.jtag_debug_module avalon
set_connection_parameter_value cpu_stage5.instruction_master/cpu_stage5.jtag_debug_module baseAddress 0x00020800
add_connection cpu_stage5.instruction_master ram_stage5.s1 avalon
set_connection_parameter_value cpu_stage5.instruction_master/ram_stage5.s1 baseAddress 0x00010000
add_connection cpu_stage6.data_master cpu_stage6.jtag_debug_module avalon
set_connection_parameter_value cpu_stage6.data_master/cpu_stage6.jtag_debug_module baseAddress 0x00040800
add_connection cpu_stage6.data_master fifo_1to6_fname.out avalon
set_connection_parameter_value cpu_stage6.data_master/fifo_1to6_fname.out baseAddress 0x00041068
add_connection cpu_stage6.data_master fifo_1to6_fname.out_csr avalon
set_connection_parameter_value cpu_stage6.data_master/fifo_1to6_fname.out_csr baseAddress 0x00041000
add_connection cpu_stage6.data_master fifo_5to6_data.out avalon
set_connection_parameter_value cpu_stage6.data_master/fifo_5to6_data.out baseAddress 0x00041070
add_connection cpu_stage6.data_master fifo_5to6_data.out_csr avalon
set_connection_parameter_value cpu_stage6.data_master/fifo_5to6_data.out_csr baseAddress 0x00041040
add_connection cpu_stage6.data_master fifo_5to6_done.out avalon
set_connection_parameter_value cpu_stage6.data_master/fifo_5to6_done.out baseAddress 0x0004106c
add_connection cpu_stage6.data_master fifo_5to6_done.out_csr avalon
set_connection_parameter_value cpu_stage6.data_master/fifo_5to6_done.out_csr baseAddress 0x00041020
add_connection cpu_stage6.data_master jtag_uart_6.avalon_jtag_slave avalon
set_connection_parameter_value cpu_stage6.data_master/jtag_uart_6.avalon_jtag_slave baseAddress 0x00041060
add_connection cpu_stage6.data_master ram_stage6.s1 avalon
set_connection_parameter_value cpu_stage6.data_master/ram_stage6.s1 baseAddress 0x00020000
add_connection cpu_stage6.data_master timer_1.s1 avalon
set_connection_parameter_value cpu_stage6.data_master/timer_1.s1 baseAddress 0x080410c0
add_connection cpu_stage6.instruction_master cpu_stage6.jtag_debug_module avalon
set_connection_parameter_value cpu_stage6.instruction_master/cpu_stage6.jtag_debug_module baseAddress 0x00040800
add_connection cpu_stage6.instruction_master ram_stage6.s1 avalon
set_connection_parameter_value cpu_stage6.instruction_master/ram_stage6.s1 baseAddress 0x00020000
add_connection cpu_stage1.d_irq jtag_uart_1.irq interrupt
set_connection_parameter_value cpu_stage1.d_irq/jtag_uart_1.irq irqNumber 0
add_connection cpu_stage1.d_irq timer_1.irq interrupt
set_connection_parameter_value cpu_stage1.d_irq/timer_1.irq irqNumber 1
add_connection cpu_stage2.d_irq jtag_uart_2.irq interrupt
set_connection_parameter_value cpu_stage2.d_irq/jtag_uart_2.irq irqNumber 1
add_connection cpu_stage2.d_irq timer_1.irq interrupt
set_connection_parameter_value cpu_stage2.d_irq/timer_1.irq irqNumber 0
add_connection cpu_stage3.d_irq jtag_uart_3.irq interrupt
set_connection_parameter_value cpu_stage3.d_irq/jtag_uart_3.irq irqNumber 0
add_connection cpu_stage3.d_irq timer_1.irq interrupt
set_connection_parameter_value cpu_stage3.d_irq/timer_1.irq irqNumber 1
add_connection cpu_stage4.d_irq jtag_uart_4.irq interrupt
set_connection_parameter_value cpu_stage4.d_irq/jtag_uart_4.irq irqNumber 0
add_connection cpu_stage4.d_irq timer_1.irq interrupt
set_connection_parameter_value cpu_stage4.d_irq/timer_1.irq irqNumber 1
add_connection cpu_stage5.d_irq jtag_uart_5.irq interrupt
set_connection_parameter_value cpu_stage5.d_irq/jtag_uart_5.irq irqNumber 0
add_connection cpu_stage5.d_irq timer_1.irq interrupt
set_connection_parameter_value cpu_stage5.d_irq/timer_1.irq irqNumber 1
add_connection cpu_stage6.d_irq jtag_uart_6.irq interrupt
set_connection_parameter_value cpu_stage6.d_irq/jtag_uart_6.irq irqNumber 0
add_connection cpu_stage6.d_irq timer_1.irq interrupt
set_connection_parameter_value cpu_stage6.d_irq/timer_1.irq irqNumber 1

# exported interfaces
add_interface clk clock sink
set_interface_property clk EXPORT_OF clk_0.clk_in
add_interface reset reset sink
set_interface_property reset EXPORT_OF clk_0.clk_in_reset
add_interface sdram_wire conduit end
set_interface_property sdram_wire EXPORT_OF sdram_controller_stage1.wire
add_interface sdram_clk clock source
set_interface_property sdram_clk EXPORT_OF altpll_0.c1

set_interconnect_requirement {$system} qsys_mm.clockCrossingAdapter HANDSHAKE
set_interconnect_requirement {$system} qsys_mm.maxAdditionalLatency 1
set_interconnect_requirement {$system} qsys_mm.insertDefaultSlave false

save_system MPSoC.qsys
